# EAGLE design EMG_PCB_Open-source (EAGLE 9.6.2)
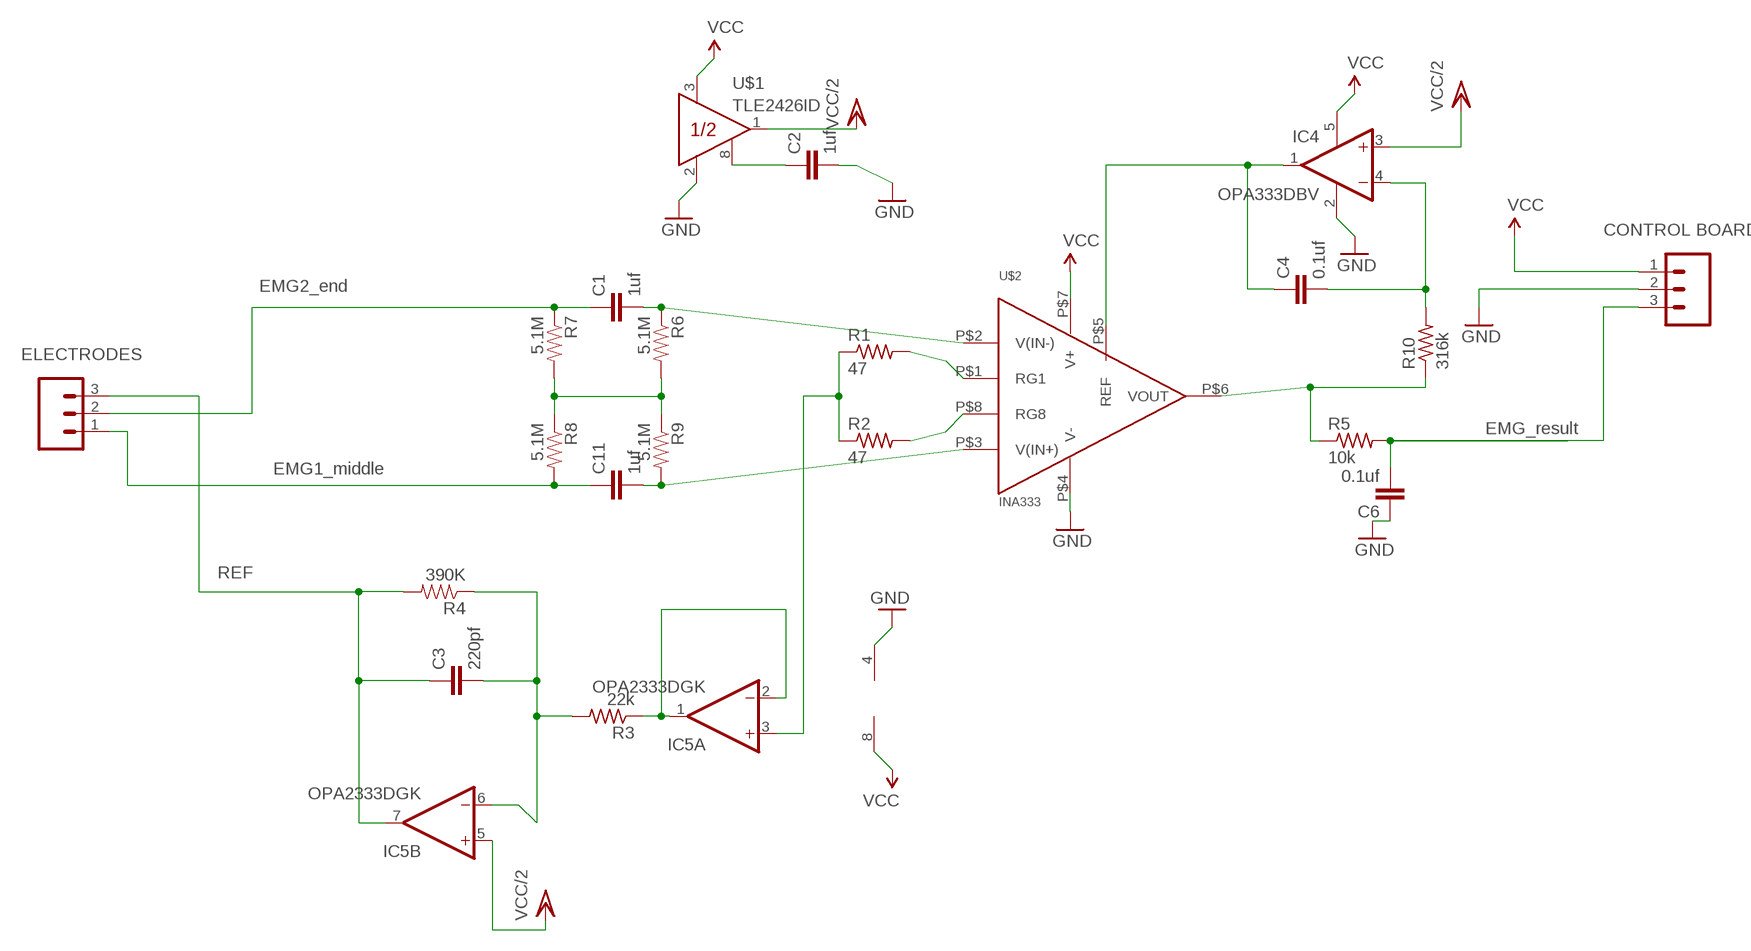
[diagram p0: schematic, sheet 1]

## Parts
C1  1uf  C-EUC0603  [C0603]
C2  1uf  C-EUC0603  [C0603]
C3  220pf  C-EUC0603  [C0603]
C4  0.1uf  C-EUC0603  [C0603]
C6  0.1uf  C-EUC0603  [C0603]
C11  1uf  C-EUC0603  [C0603]
IC4  OPA333DBV  [SOT23-5]
IC5  OPA2333DGK  [MSOP08]
J1  455-1750-1-ND  CONN_03  [1X03]
J2  455-1750-1-ND  CONN_03  [1X03]
R1  47  R-US_R0603  [R0603]
R2  47  R-US_R0603  [R0603]
R3  22k  R-US_R0603  [R0603]
R4  390K  RESISTOR0603-RES  [0603-RES]
R5  10k  R-US_R0603  [R0603]
R6  5.1M  RESISTOR0603-RES  [0603-RES]
R7  5.1M  RESISTOR0603-RES  [0603-RES]
R8  5.1M  RESISTOR0603-RES  [0603-RES]
R9  5.1M  RESISTOR0603-RES  [0603-RES]
R10  316k  R-US_R0603  [R0603]
U$1  TLE2426ID  [SO-8]
U$2  INA333  [8-MSOP]

## Nets
ADC0: C6.2 J2.3 R5.2
GND: C2.2 C6.1 IC4.2(V-) IC5.4(P:V-) J2.2 U$1.2(COM) U$2.P$4(V-)
N$1: R1.2 U$2.P$1(RG1)
N$2: R2.2 U$2.P$8(RG8)
N$3: C1.1 J1.2 R7.1
N$4: R6.2 R7.2 R8.1 R9.1
N$5: C1.2 R6.1 U$2.P$2(V(IN-))
N$6: C11.2 R9.2 U$2.P$3(V(IN+))
N$7: C11.1 J1.1 R8.2
N$8: IC5.3(A:+IN) R1.1 R2.1
N$9: C2.1 U$1.8(NR)
N$10: C3.2 IC5.6(B:-IN) R3.2 R4.1
N$11: C3.1 IC5.7(B:OUT) J1.3 R4.2
N$14: C4.2 IC4.4(-IN) R10.2
N$15: C4.1 IC4.1(OUT) U$2.P$5(REF)
N$16: IC5.1(A:OUT) IC5.2(A:-IN) R3.1
N$28: R5.1 R10.1 U$2.P$6(VOUT)
VCC: IC4.5(V+) IC5.8(P:V+) J2.1 U$1.3(IN) U$2.P$7(V+)
VCC/2: IC4.3(+IN) IC5.5(B:+IN) U$1.1(OUT)

## Notes on the sheet
- CONTROL BOARD
- EMG2_end
- ELECTRODES
- EMG_result
- EMG1_middle
- REF

## Library data of the parts
C1-C4 C6 C11 = rcl:C-EU: CAPACITOR, European symbol
IC4 = linear:OPA333: 1.8V, microPOWER CMOS OPERATIONAL AMPLIFIERS Zerø-Drift Series Source: Texas Instruments (Burr-Brown) .. U11 opa333 Operational Amp.pdf
IC5 = linear:OPA2333: DUAL 1.8V, microPOWER CMOS OPERATIONAL AMPLIFIERS Zerø-Drift Series Source: Texas Instruments (Burr-Brown) .. U11 opa333 Operational Amp.pdf
J1 J2 = SparkFun-Connectors:CONN_03: Multi connection point. Often used as Generic Header-pin footprint for 0.1 inch spaced/style header connections On any of the 0.1 inch spaced packages, you can populate with these: Break Away Headers - Straight <https://www.sparkfun.com/products/116> (PRT-00116) Break Away Male Headers - Right Angle <https://www.sparkfun.com/products/553> (PRT-00553) Female Headers <https://www.sparkfun.com/products/115> (PRT-00115) Break Away Headers - Machine Pin <https://www.sparkfun.com/products/117> (PRT-00117) Break Away Female Headers - Swiss Machine Pin <https://www.sparkfun.com/products/743> (PRT-00743) Stackable Header - 3 Pin (Female, 0.1") <https://www.sparkfun.com/products/13875> (PRT-13875) For SCREWTERMINALS and SPRING TERMINALS visit here: Screw Terimnals on SparkFun.com <https://www.sparkfun.com/search/results?term=Screw+Terminals> (5mm/3.5mm/2.54mm spacing) This device is also useful as a general connection point to wire up your design to another part of your project. Our various solder wires solder well into these plated through hole pads. Hook-Up Wire - Assortment (Stranded, 22 AWG) <https://www.sparkfun.com/products/11375> (PRT-11375) Hook-Up Wire - Assortment (Solid Core, 22 AWG) <https://www.sparkfun.com/products/11367> (PRT-11367) View the entire wire category on our website here <https://www.sparkfun.com/categories/141> Special notes: Molex polarized connector foot print use with SKU : PRT-08232 with associated crimp pins and housings.; PROD_ID: XXX-00000
R1-R3 R5 R10 = rcl:R-US_: RESISTOR, American symbol
R4 R6-R9 = SparkFun:RESISTOR: Resistor Basic schematic elements and footprints for 0603, 1206, and PTH resistors.
U$1 = tle2426:TLE2426*: Texas Instruments "rail splitter" with noise-reduction
U$2 = Dushyantha:INA333: Texas Instruments, Micro-Power (50?A), Zero-Drift, Rail-to-Rail Out Instrumentation Amplifier

## Net classes
0 default: width 0.4 mm, drill 0.4 mm, clearance 0.2 mm

## Board
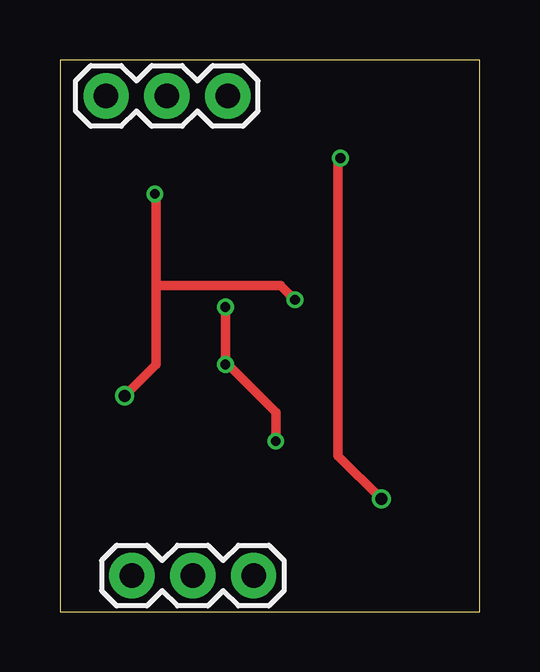
[diagram p1: board, top side]
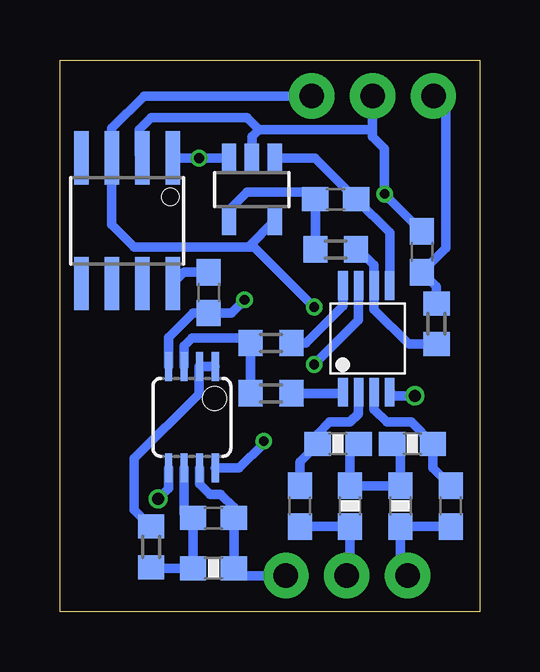
[diagram p2: board, bottom side, seen from below]

Size 17.5 x 23 mm. Coordinates in mm from the lower left corner, seen from the top.
Outline: 0,0 17.5,0 17.5,23 0,23 0,0
Copper layers (1*16): Top 0.035mm / dielectric 1.53mm / Bottom 0.035mm
Design rules "default *": minimum track width 5mil, minimum drill 0.3mm, track to track 0.2mm, track to pad 0.2mm, pad to pad 0.2mm, via to via 0.2mm, smd to smd 0.2mm, copper to edge 0.5mm, drill to drill 0.5mm, minimum pad ring 0.15mm, minimum via ring 0.15mm, stop-mask expansion 4mil, vias tented up to drill 0.35mm, thermal gap 10mil

### Footprints (pad centres in the part's own frame; a part is rotated, then mirrored left to right if it is on the bottom)
C0603 = smd 1.1 x 1: 1 -0.85,0; 2 0.85,0
SOT23-5 = smd 0.6 x 1.2: 1 -0.95,-1.306; 2 0,-1.306; 3 0.95,-1.306; 4 0.95,1.306; 5 -0.95,1.306
MSOP08 = smd 0.3 x 1.2: 1 -0.976,-2.113; 2 -0.326,-2.113; 3 0.324,-2.113; 4 0.974,-2.113; 5 0.974,2.112; 6 0.324,2.112; 7 -0.326,2.112; 8 -0.976,2.112
1X03 = drill 1.016 pad 1.88: 1 0,0; 2 2.54,0; 3 5.08,0
R0603 = smd 1 x 1.1: 1 -0.85,0; 2 0.85,0
0603-RES = smd 1.1 x 1: 1 -0.85,0; 2 0.85,0
SO-8 = smd 0.61 x 2.21: 1 -1.905,-2.616; 2 -0.635,-2.616; 3 0.635,-2.616; 4 1.905,-2.616; 5 1.905,2.616; 6 0.635,2.616; 7 -0.635,2.616; 8 -1.905,2.616
8-MSOP = smd 1.2 x 0.4: P$1 -2.35,1.1; P$2 -2.35,0.45; P$3 -2.35,-0.2; P$4 -2.35,-0.85; P$5 2.1,-0.85; P$6 2.1,-0.2; P$7 2.1,0.45; P$8 2.1,1.1

### Placement (x,y rotation side)
C1  7.5,4.4 90 bottom
C2  11.3,13.3 270 bottom
C3  11.1,3.9 180 bottom
C4  6,17.2 180 bottom
C6  2.4,15 270 bottom
C11  1.2,4.4 90 bottom
IC4  9.5,17.6 180 bottom
IC5  12,8.1 180 bottom
J1  3,1.5 0 top
J2  7,21.5 180 top
R1  8.7,9.1 0 bottom
R2  8.7,11.2 0 bottom
R3  13.7,2.7 270 bottom
R4  11.1,1.8 0 bottom
R5  1.8,12 90 bottom
R6  5.9,7 0 bottom
R7  5.4,4.4 90 bottom
R8  3.3,4.4 270 bottom
R9  2.8,7 0 bottom
R10  6,15.1 180 bottom
U$1  14.7,16.3 180 bottom
U$2  4.6,11.5 90 bottom

### Tracks (layer width: path | path; a pad name or v marks a point on that pad's centre or on a via)
ADC0
  Bottom 0.4: J2.3 1.4,21.48 1.4,15.15 C6.2 1.8,13.55 R5.2
GND  (via drill 0.4, 0.5)
  Top 0.4: v2.7,9 4,10.3 4,13.6 | 4,13.6 4,17.5 3.96,17.46 v3.96,17.41 | v9.8,13 9.2,13.6 4,13.6
  Bottom 0.4: v2.7,9 3.6,9 U$2.P$4 | C6.1 v3.96,17.41 3.96,19.3 4.46,19.8 4.46,20.1 | IC5.4 12.97,11.43 11.95,12.45 C2.2 10.35,12.45 v9.8,13 | U$1.2 14.2,19.05 14.2,20.1 13.7,20.6 9.7,20.6 9.2,20.1 | J2.2 4.46,20.1 | 4.46,20.1 9.2,20.1 | 9.2,20.1 9.5,19.8 IC4.2
N$1
  Bottom 0.4: U$2.P$1 5.75,9.1 R1.2
N$2
  Bottom 0.4: U$2.P$8 5.7,12.75 7.25,11.2 R2.2
N$3
  Bottom 0.4: C1.1 R7.1 5.4,1.64 J1.2
N$4
  Bottom 0.4: R6.2 5.4,6.65 R7.2 R8.1 3.3,6.65 R9.1
N$5
  Bottom 0.4: C1.2 7.5,6.25 R6.1 6.75,7.42 6.27,7.9 5.4,7.9 5.05,8.25 U$2.P$2
N$6
  Bottom 0.4: C11.2 1.95,6 R9.2 2.85,7.9 3.87,7.9 4.4,8.43 U$2.P$3
N$7
  Bottom 0.4: J1.1 3.3,1.8 R8.2 C11.1
N$8
  Bottom 0.4: IC5.3 12.32,11.08 12,11.4 9.75,11.4 R2.1 R1.1
N$9
  Bottom 0.4: C2.1 12.33,14.15 U$1.8
N$10
  Bottom 0.4: 11.95,3.7 R4.1 13.65,1.8 R3.2 | 11.95,3.7 C3.2 | 11.95,3.7 12.32,4.07 IC5.6
N$11
  Bottom 0.4: J1.3 9.95,1.5 R4.2 C3.1 10.25,4.34 10.8,4.89 11.24,4.89 11.67,5.32 IC5.7
N$14
  Bottom 0.4: R10.2 C4.2 7.15,17.5 9.7,17.5 10.45,16.75 IC4.4
N$15
  Bottom 0.4: U$2.P$5 3.75,15.8 C4.1 6.86,18.91 IC4.1
N$16
  Bottom 0.4: IC5.1 IC5.2 11.7,10.21 11.7,9.08 14.4,6.38 14.4,4.25 R3.1
N$28
  Bottom 0.4: R5.1 2.95,11.15 4.4,12.6 U$2.P$6 4.4,14.45 5.05,15.1 R10.1
VCC  (via drill 0.4)
  Top 0.4: v9,7.1 9,8.3 7,10.3 v6.9,10.3 v6.9,12.7
  Bottom 0.4: v9,7.1 9,7.01 10.02,5.99 IC5.8 | J2.1 14,21.5 15.34,20.16 U$1.3 15.34,16.14 14.4,15.2 9.64,15.2 | v6.9,10.3 5.05,12.15 U$2.P$7 | v6.9,12.7 9.4,15.2 9.64,15.2 | IC4.5 9.64,15.2
VCC/2  (via drill 0.4, 0.5)
  Top 0.4: v13.4,4.7 11.6,6.5 11.6,18.8 v11.7,18.9 v11.7,18.91
  Bottom 0.4: v13.4,4.7 12.97,5.13 IC5.5 | IC4.3 v11.7,18.91 12.79,18.91 U$1.1